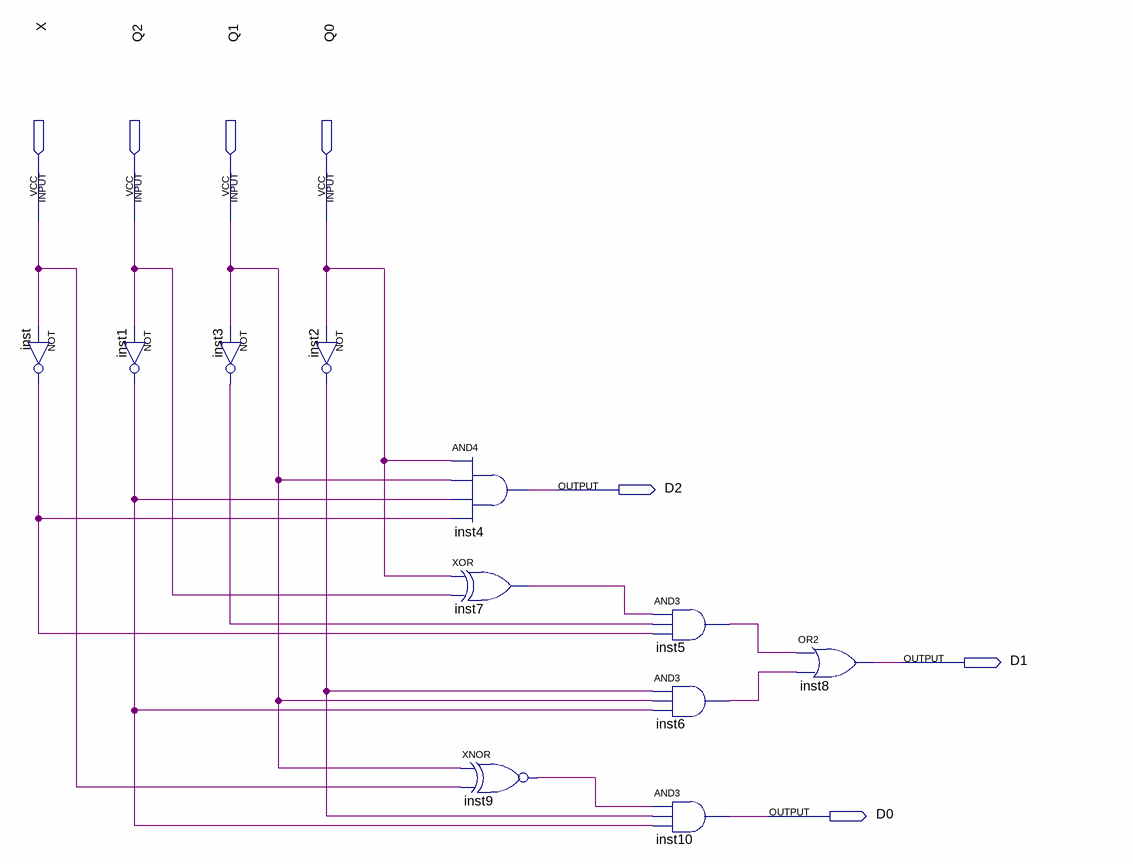
[diagram p0: schematic sheet]
// Quartus schematic lab2_1.bdf as structural Verilog: 11 symbols, 7 pins
module lab2_1 (
  input  X,
  input  Q2,
  input  Q1,
  input  Q0,
  output D2,
  output D1,
  output D0
);

  wire inst1_out, inst2_out, inst3_out, inst5_out, inst6_out, inst7_out, inst9_out, inst_out;

  not inst (inst_out, X);
  not inst1 (inst1_out, Q2);
  not inst3 (inst3_out, Q1);
  not inst2 (inst2_out, Q0);
  and inst4 (D2, Q0, Q1, inst1_out, inst_out);
  xor inst7 (inst7_out, Q0, Q2);
  xnor inst9 (inst9_out, Q1, X);
  and inst5 (inst5_out, inst7_out, inst3_out, inst_out);
  and inst6 (inst6_out, inst2_out, Q1, inst1_out);
  and inst10 (D0, inst9_out, inst2_out, inst1_out);
  or inst8 (D1, inst5_out, inst6_out);
endmodule
